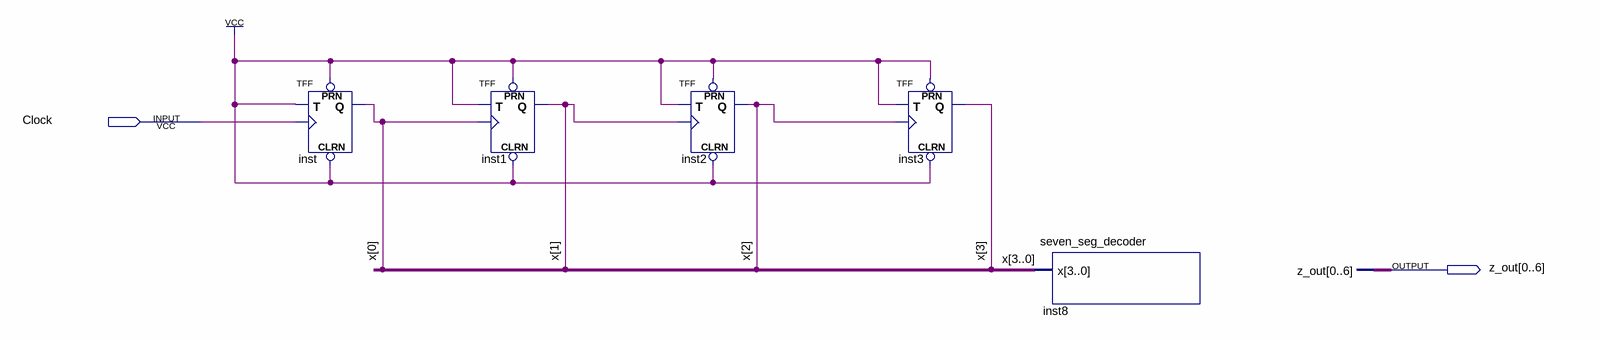
[diagram p0: schematic sheet]
// Quartus schematic lab10step3b.bdf as structural Verilog: 5 symbols, 2 pins
module lab10step3b (
  input  Clock,
  output [0:6] z_out
);

  wire [3:0] x;

  TFF inst (.PRN(1'b1), .CLRN(1'b1), .T(1'b1), .CLK(Clock), .Q(x[0]));
  TFF inst1 (.PRN(1'b1), .CLRN(1'b1), .T(1'b1), .CLK(x[0]), .Q(x[1]));
  TFF inst2 (.PRN(1'b1), .CLRN(1'b1), .T(1'b1), .CLK(x[1]), .Q(x[2]));
  TFF inst3 (.PRN(1'b1), .CLRN(1'b1), .T(1'b1), .CLK(x[2]), .Q(x[3]));
  seven_seg_decoder inst8 (.x(x), .z_out(z_out));
endmodule
